# EAGLE design PowerMatrix_1_1 (EAGLE 4.16)
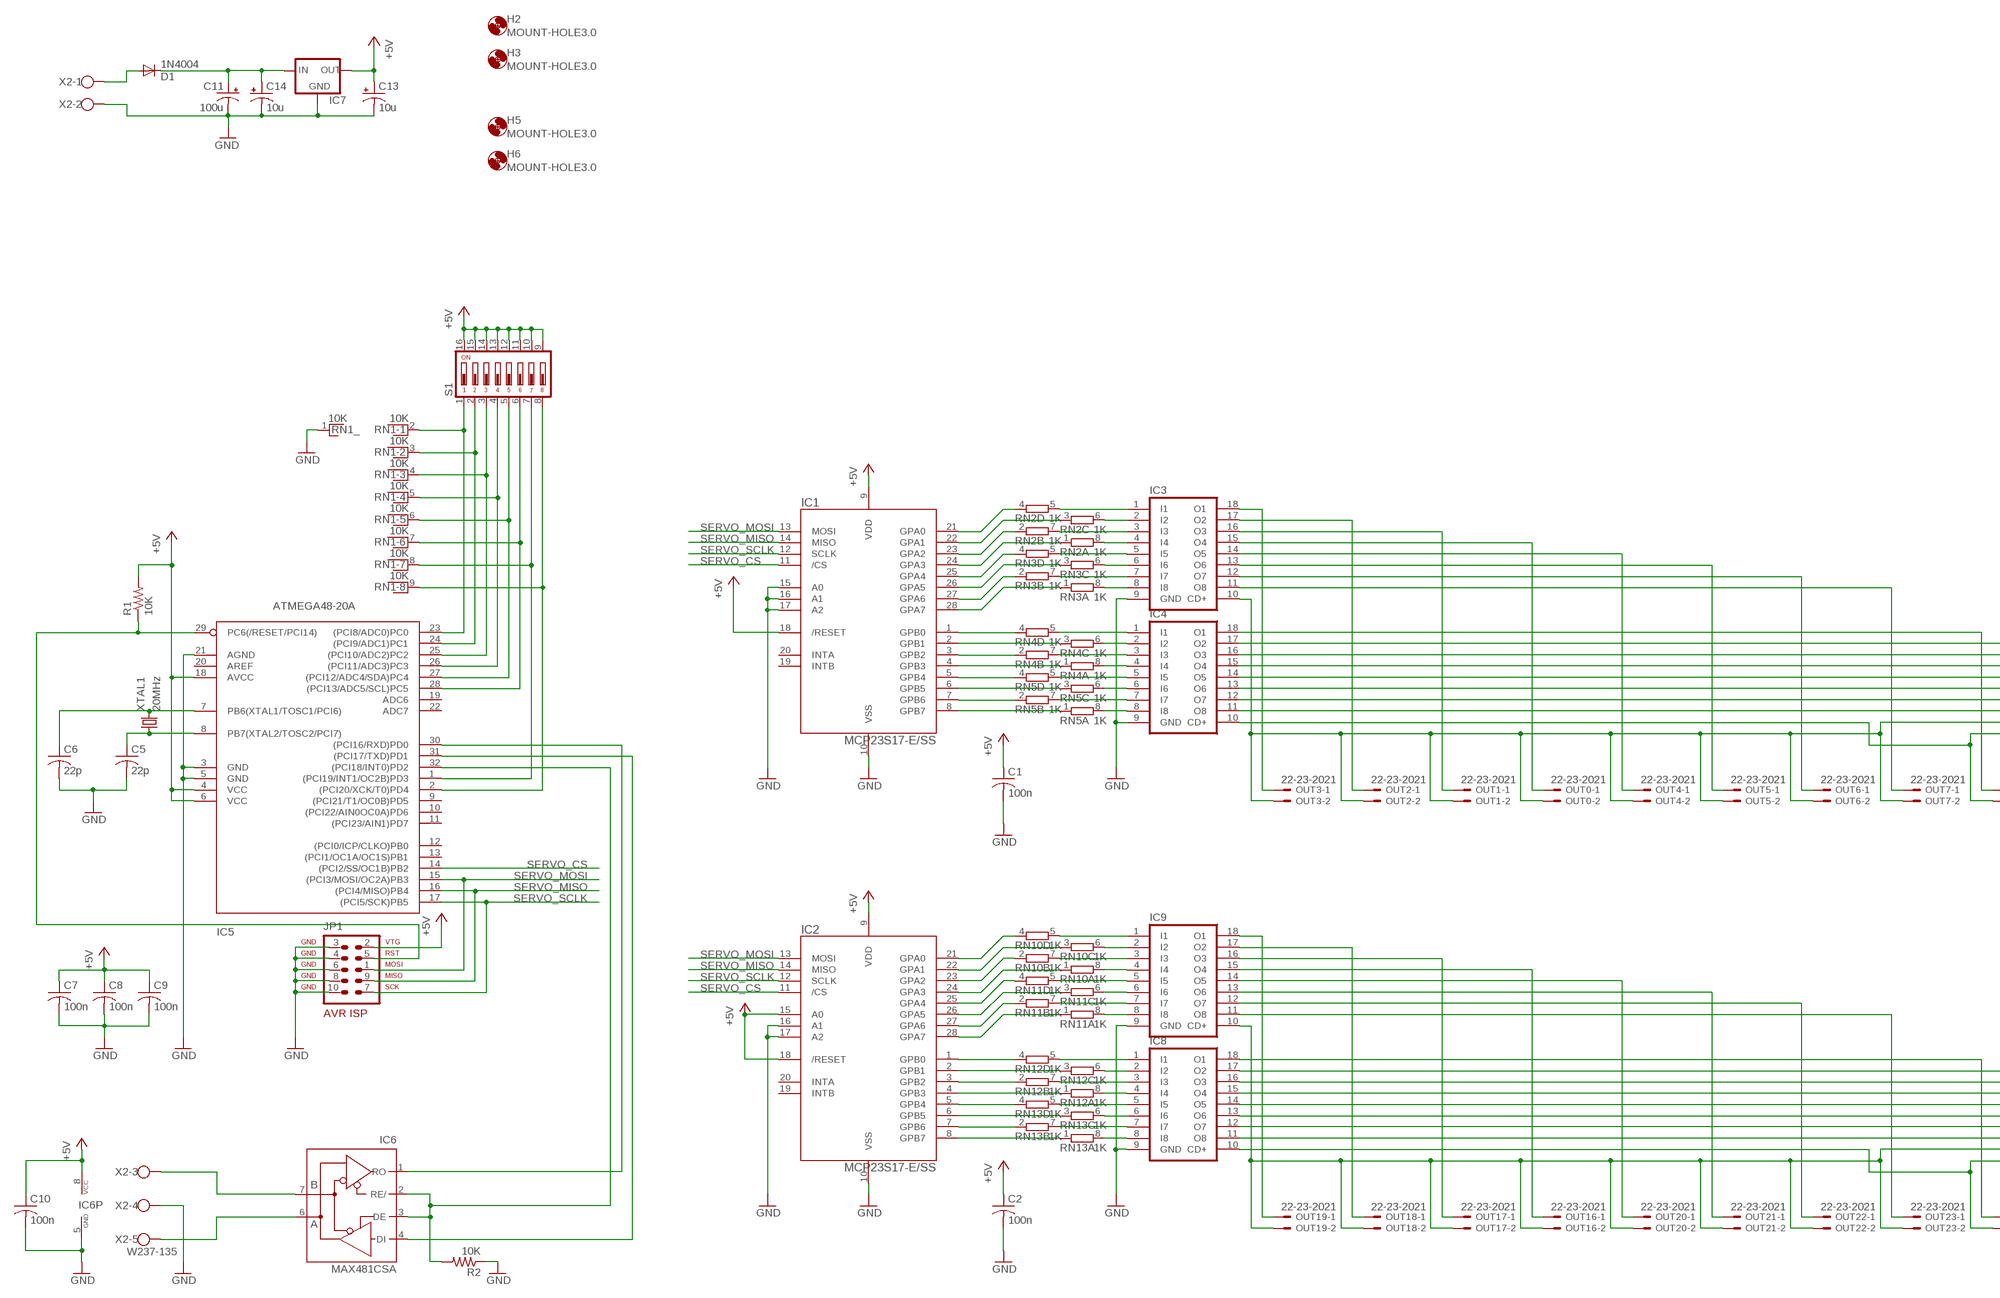
[diagram p0: schematic, sheet 1, part 1 of 2]
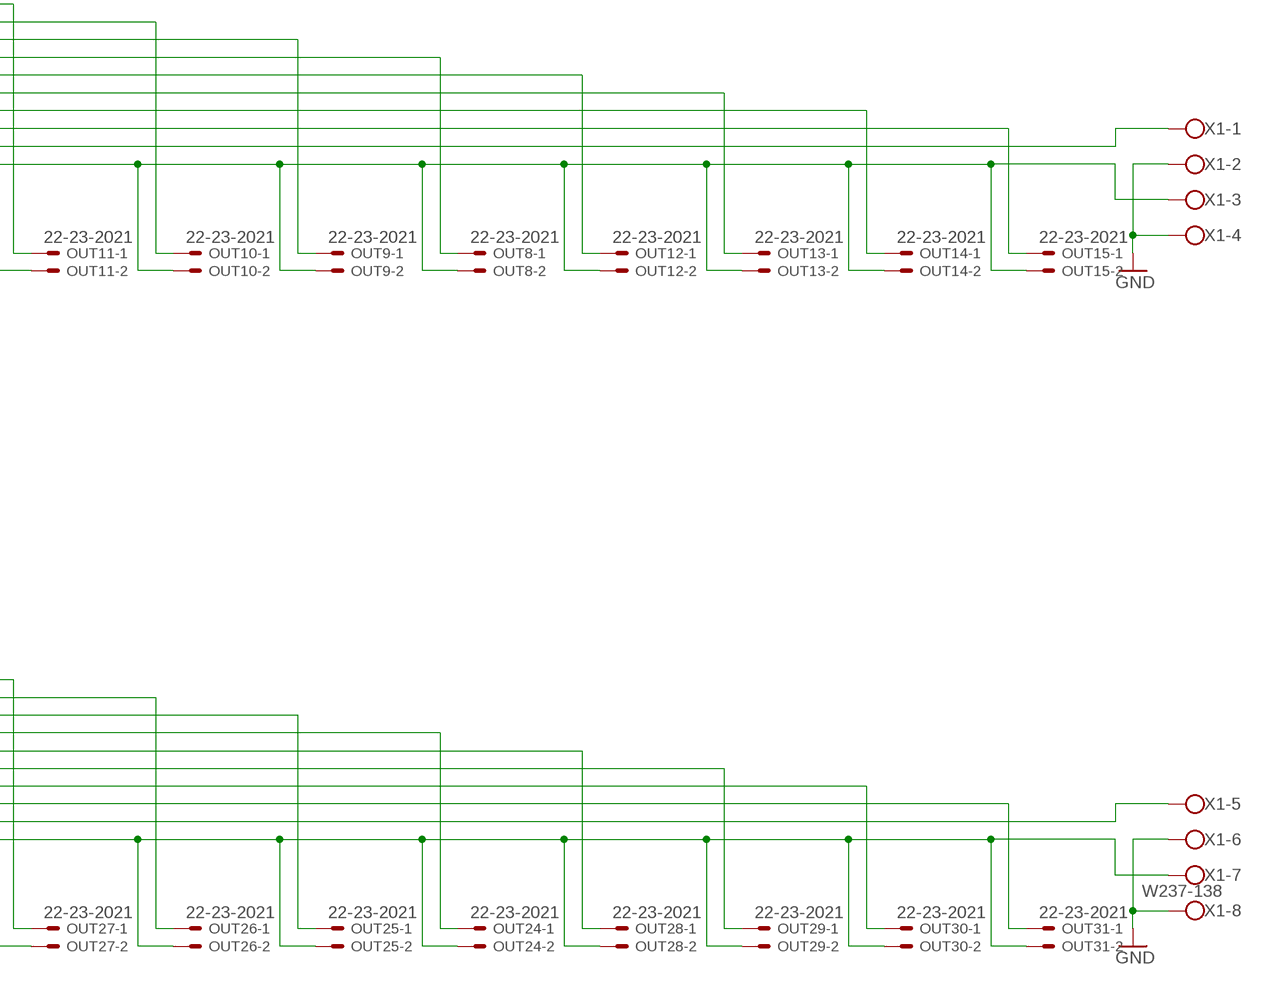
[diagram p1: schematic, sheet 1, part 2 of 2]

## Parts
C1  100n  C-USC0805  [C0805]
C2  100n  C-USC0805  [C0805]
C5  22p  C-USC0805  [C0805]
C6  22p  C-USC0805  [C0805]
C7  100n  C-USC0805  [C0805]
C8  100n  C-USC0805  [C0805]
C9  100n  C-USC0805  [C0805]
C10  100n  C-USC0805  [C0805]
C11  100u  CPOL-USD  [PANASONIC_D]
C13  10u  CPOL-USB  [PANASONIC_B]
C14  10u  CPOL-USB  [PANASONIC_B]
D1  1N4004  [DO41-10]
H2  MOUNT-HOLE3.0  [3,0]
H3  MOUNT-HOLE3.0  [3,0]
H5  MOUNT-HOLE3.0  [3,0]
H6  MOUNT-HOLE3.0  [3,0]
IC1  MCP23S17-E/SS  MCP23S17-E/SS-MFG  [SSOP-28-MFG]
IC2  MCP23S17-E/SS  MCP23S17-E/SS-MFG  [SSOP-28-MFG]
IC3  ULN2803A  [DIL18]
IC4  ULN2803A  [DIL18]
IC5  ATMEGA48-20A  [TQFP32-08]
IC6  MAX481CSA  [SO08]
IC7  LM1117  [SOT223]
IC8  ULN2803A  [DIL18]
IC9  ULN2803A  [DIL18]
JP1  AVR-ISP-10ML  [ML10]
OUT0  22-23-2021  [22-23-2021]
OUT1  22-23-2021  [22-23-2021]
OUT2  22-23-2021  [22-23-2021]
OUT3  22-23-2021  [22-23-2021]
OUT4  22-23-2021  [22-23-2021]
OUT5  22-23-2021  [22-23-2021]
OUT6  22-23-2021  [22-23-2021]
OUT7  22-23-2021  [22-23-2021]
OUT8  22-23-2021  [22-23-2021]
OUT9  22-23-2021  [22-23-2021]
OUT10  22-23-2021  [22-23-2021]
OUT11  22-23-2021  [22-23-2021]
OUT12  22-23-2021  [22-23-2021]
OUT13  22-23-2021  [22-23-2021]
OUT14  22-23-2021  [22-23-2021]
OUT15  22-23-2021  [22-23-2021]
OUT16  22-23-2021  [22-23-2021]
OUT17  22-23-2021  [22-23-2021]
OUT18  22-23-2021  [22-23-2021]
OUT19  22-23-2021  [22-23-2021]
OUT20  22-23-2021  [22-23-2021]
OUT21  22-23-2021  [22-23-2021]
OUT22  22-23-2021  [22-23-2021]
OUT23  22-23-2021  [22-23-2021]
OUT24  22-23-2021  [22-23-2021]
OUT25  22-23-2021  [22-23-2021]
OUT26  22-23-2021  [22-23-2021]
OUT27  22-23-2021  [22-23-2021]
OUT28  22-23-2021  [22-23-2021]
OUT29  22-23-2021  [22-23-2021]
OUT30  22-23-2021  [22-23-2021]
OUT31  22-23-2021  [22-23-2021]
R1  10K  R-US_M0805  [M0805]
R2  10K  R-US_M0805  [M0805]
RN1  10K  RNX9  [RN-10]
RN2  1K  4R-N0603-ARC  [0603-ARC]
RN3  1K  4R-N0603-ARC  [0603-ARC]
RN4  1K  4R-N0603-ARC  [0603-ARC]
RN5  1K  4R-N0603-ARC  [0603-ARC]
RN10  1K  4R-N0603-ARC  [0603-ARC]
RN11  1K  4R-N0603-ARC  [0603-ARC]
RN12  1K  4R-N0603-ARC  [0603-ARC]
RN13  1K  4R-N0603-ARC  [0603-ARC]
S1  DIP08YL  [DIP08YL]
X1  W237-138  [W237-138]
X2  W237-135  [W237-135]
XTAL1  20MHz  CRYSTALHC49S  [HC49/S]

## Nets
+5V: C1.1 C2.1 C7.1 C8.1 C9.1 C10.1 C13.+ IC1.9(VDD) IC1.18(/RESET) IC2.9(VDD) IC2.15(A0) IC2.18(/RESET) IC5.4(VCC) IC5.6(VCC) IC5.18(AVCC) IC6.8(VCC) IC7.2(OUT) JP1.2 R1.2 S1.9 S1.10 S1.11 S1.12 S1.13 S1.14 S1.15 S1.16
GND: C1.2 C2.2 C5.2 C6.2 C7.2 C8.2 C9.2 C10.2 C11.- C13.- C14.- IC1.10(VSS) IC1.15(A0) IC1.16(A1) IC1.17(A2) IC2.10(VSS) IC2.16(A1) IC2.17(A2) IC3.9(GND) IC4.9(GND) IC5.3(GND) IC5.5(GND) IC5.21(AGND) IC6.5(GND) IC7.1(GND) IC8.9(GND) IC9.9(GND) JP1.3 JP1.4 JP1.6 JP1.8 JP1.10 R2.1 RN1.1 X1.2 X1.4 X1.6 X1.8 X2.2 X2.4
N$1: IC3.18(O1) OUT3.1
N$2: IC1.21(GPA0) RN2.4
N$3: IC3.17(O2) OUT2.1
N$4: IC1.22(GPA1) RN2.3
N$5: IC3.16(O3) OUT1.1
N$6: IC1.23(GPA2) RN2.2
N$7: IC3.15(O4) OUT0.1
N$8: IC1.24(GPA3) RN2.1
N$9: IC3.14(O5) OUT4.1
N$10: IC1.25(GPA4) RN3.4
N$11: IC3.13(O6) OUT5.1
N$12: IC1.26(GPA5) RN3.3
N$13: IC3.12(O7) OUT6.1
N$14: IC1.27(GPA6) RN3.2
N$15: IC3.11(O8) OUT7.1
N$16: IC1.28(GPA7) RN3.1
N$17: IC4.18(O1) OUT11.1
N$18: IC1.8(GPB7) RN5.1
N$19: IC4.17(O2) OUT10.1
N$20: IC1.7(GPB6) RN5.2
N$21: IC4.16(O3) OUT9.1
N$22: IC1.6(GPB5) RN5.3
N$23: IC4.15(O4) OUT8.1
N$24: IC1.5(GPB4) RN5.4
N$25: IC4.14(O5) OUT12.1
N$26: IC1.4(GPB3) RN4.1
N$27: IC4.13(O6) OUT13.1
N$28: IC1.3(GPB2) RN4.2
N$29: IC4.12(O7) OUT14.1
N$30: IC1.2(GPB1) RN4.3
N$31: IC4.11(O8) OUT15.1
N$32: IC1.1(GPB0) RN4.4
N$33: IC3.1(I1) RN2.5
N$34: IC3.2(I2) RN2.6
N$35: IC4.10(CD+) OUT8.2 OUT9.2 OUT10.2 OUT11.2 OUT12.2 OUT13.2 OUT14.2 OUT15.2 X1.3
N$36: IC3.3(I3) RN2.7
N$37: IC3.4(I4) RN2.8
N$38: IC3.5(I5) RN3.5
N$39: IC3.6(I6) RN3.6
N$40: IC3.7(I7) RN3.7
N$41: IC3.8(I8) RN3.8
N$42: IC9.10(CD+) OUT16.2 OUT17.2 OUT18.2 OUT19.2 OUT20.2 OUT21.2 OUT22.2 OUT23.2 X1.5
N$43: IC4.1(I1) RN4.5
N$44: IC4.3(I3) RN4.7
N$45: IC4.2(I2) RN4.6
N$46: IC4.4(I4) RN4.8
N$47: IC4.5(I5) RN5.5
N$48: IC4.6(I6) RN5.6
N$49: IC4.7(I7) RN5.7
N$50: IC4.8(I8) RN5.8
N$51: IC2.21(GPA0) RN10.4
N$52: IC2.22(GPA1) RN10.3
N$53: IC9.18(O1) OUT19.1
N$54: IC2.23(GPA2) RN10.2
N$55: IC9.17(O2) OUT18.1
N$56: IC2.24(GPA3) RN10.1
N$57: IC9.16(O3) OUT17.1
N$58: IC2.25(GPA4) RN11.4
N$59: IC9.15(O4) OUT16.1
N$60: IC2.26(GPA5) RN11.3
N$61: IC9.14(O5) OUT20.1
N$62: IC2.27(GPA6) RN11.2
N$63: IC9.13(O6) OUT21.1
N$64: IC2.28(GPA7) RN11.1
N$65: IC9.12(O7) OUT22.1
N$66: IC2.8(GPB7) RN13.1
N$67: IC9.11(O8) OUT23.1
N$68: IC2.7(GPB6) RN13.2
N$69: IC8.18(O1) OUT27.1
N$70: IC2.6(GPB5) RN13.3
N$71: IC8.17(O2) OUT26.1
N$72: IC2.5(GPB4) RN13.4
N$73: IC8.16(O3) OUT25.1
N$74: IC2.4(GPB3) RN12.1
N$75: IC8.15(O4) OUT24.1
N$76: IC2.3(GPB2) RN12.2
N$77: IC8.14(O5) OUT28.1
N$78: IC2.2(GPB1) RN12.3
N$79: IC8.13(O6) OUT29.1
N$80: IC2.1(GPB0) RN12.4
N$81: IC8.12(O7) OUT30.1
N$82: IC8.8(I8) RN13.8
N$83: IC8.11(O8) OUT31.1
N$84: IC8.7(I7) RN13.7
N$85: IC8.10(CD+) OUT24.2 OUT25.2 OUT26.2 OUT27.2 OUT28.2 OUT29.2 OUT30.2 OUT31.2 X1.7
N$86: IC8.6(I6) RN13.6
N$87: C6.1 IC5.7(PB6(XTAL1/TOSC1/PCI6)) XTAL1.2
N$88: C5.1 IC5.8(PB7(XTAL2/TOSC2/PCI7)) XTAL1.1
N$89: IC8.5(I5) RN13.5
N$90: IC8.4(I4) RN12.8
N$91: IC8.3(I3) RN12.7
N$92: IC8.2(I2) RN12.6
N$93: IC8.1(I1) RN12.5
N$94: IC9.8(I8) RN11.8
N$95: IC9.7(I7) RN11.7
N$96: IC9.6(I6) RN11.6
N$97: IC9.5(I5) RN11.5
N$98: IC9.4(I4) RN10.8
N$99: IC9.3(I3) RN10.7
N$100: IC9.2(I2) RN10.6
N$101: IC9.1(I1) RN10.5
N$102: D1.A X2.1
N$104: C11.+ C14.+ D1.C IC7.3(IN)
N$138: IC5.23((PCI8/ADC0)PC0) RN1.2 S1.1
N$139: IC5.24((PCI9/ADC1)PC1) RN1.3 S1.2
N$140: IC5.25((PCI10/ADC2)PC2) RN1.4 S1.3
N$190: IC5.26((PCI11/ADC3)PC3) RN1.5 S1.4
N$191: IC5.27((PCI12/ADC4/SDA)PC4) RN1.6 S1.5
N$192: IC5.28((PCI13/ADC5/SCL)PC5) RN1.7 S1.6
N$209: IC5.1((PCI19/INT1/OC2B)PD3) RN1.8 S1.7
N$210: IC5.2((PCI20/XCK/T0)PD4) RN1.9 S1.8
N$226: IC5.30((PCI16/RXD)PD0) IC6.1(RO)
N$227: IC5.31((PCI17/TXD)PD1) IC6.4(DI)
N$228: IC5.32((PCI18/INT0)PD2) IC6.2(RE/) IC6.3(DE) R2.2
N$231: IC5.29(PC6(/RESET/PCI14)) JP1.5 R1.1
RS285_A: IC6.6(A) X2.5
RS485_B: IC6.7(B) X2.3
SERVO_CS: IC1.11(/CS) IC2.11(/CS) IC5.14((PCI2/SS/OC1B)PB2)
SERVO_MISO: IC1.14(MISO) IC2.14(MISO) IC5.16((PCI4/MISO)PB4) JP1.9
SERVO_MOSI: IC1.13(MOSI) IC2.13(MOSI) IC5.15((PCI3/MOSI/OC2A)PB3) JP1.1
SERVO_SCLK: IC1.12(SCLK) IC2.12(SCLK) IC5.17((PCI5/SCK)PB5) JP1.7
SRV0: IC3.10(CD+) OUT0.2 OUT1.2 OUT2.2 OUT3.2 OUT4.2 OUT5.2 OUT6.2 OUT7.2 X1.1
Unconnected: IC1.19(INTB) IC1.20(INTA) IC2.19(INTB) IC2.20(INTA) IC5.9((PCI21/T1/OC0B)PD5) IC5.10((PCI22/AIN0OC0A)PD6) IC5.11((PCI23/AIN1)PD7) IC5.12((PCI0/ICP/CLKO)PB0) IC5.13((PCI1/OC1A/OC1S)PB1) IC5.19(ADC6) IC5.20(AREF) IC5.22(ADC7) RN1.10

## Library data of the parts
C1 C2 C5-C10 = rcl:C-US: CAPACITOR, American symbol
C11 C13 C14 = rcl:CPOL-US: POLARIZED CAPACITOR, American symbol
D1 = diode:1N4004: DIODE general purpose rectifier, 1 A
H2 H3 H5 H6 = holes:MOUNT-HOLE: MOUNTING HOLE with drill center marker
IC1 IC2 = rbg-microchip-ioexpander:MCP23S17
IC3 IC4 IC8 IC9 = uln-udn:ULN2803A: DRIVER ARRAY
IC5 = avr:ATMEGA48: MICROCONTROLLER 4 Kbytes FLASH 512 Bytes SRAM 256 Bytes EEPROM USART 8-channel 10 bit ADC
IC6 = maxim:MAX481CSA: RS485 TRANSEIVER
IC7 = v-reg-3:LM1117
JP1 = atmel-1:AVR-ISP-10: AVR ISP-10 Serial Programming Header
OUT0 OUT1-OUT31 = con-molex:22-23-2021: .100" (2.54mm) Center Header - 2 Pin
R1 R2 = rcl:R-US_: RESISTOR, American symbol
RN1 = resistor-net:RNX9: RESISTOR NETWORK
RN2-RN5 RN10-RN13 = resistor-dil:4R-N: Array Chip Resistor Source: RS Component / Phycomp
S1 = switch-dil:DIP08YL: DIL/CODE SWITCH
X1 = rbg-generic-screwterm-5mm:W237-138
X2 = rbg-generic-screwterm-5mm:W237-135
XTAL1 = crystal:CRYSTAL: CRYSTAL

## Board
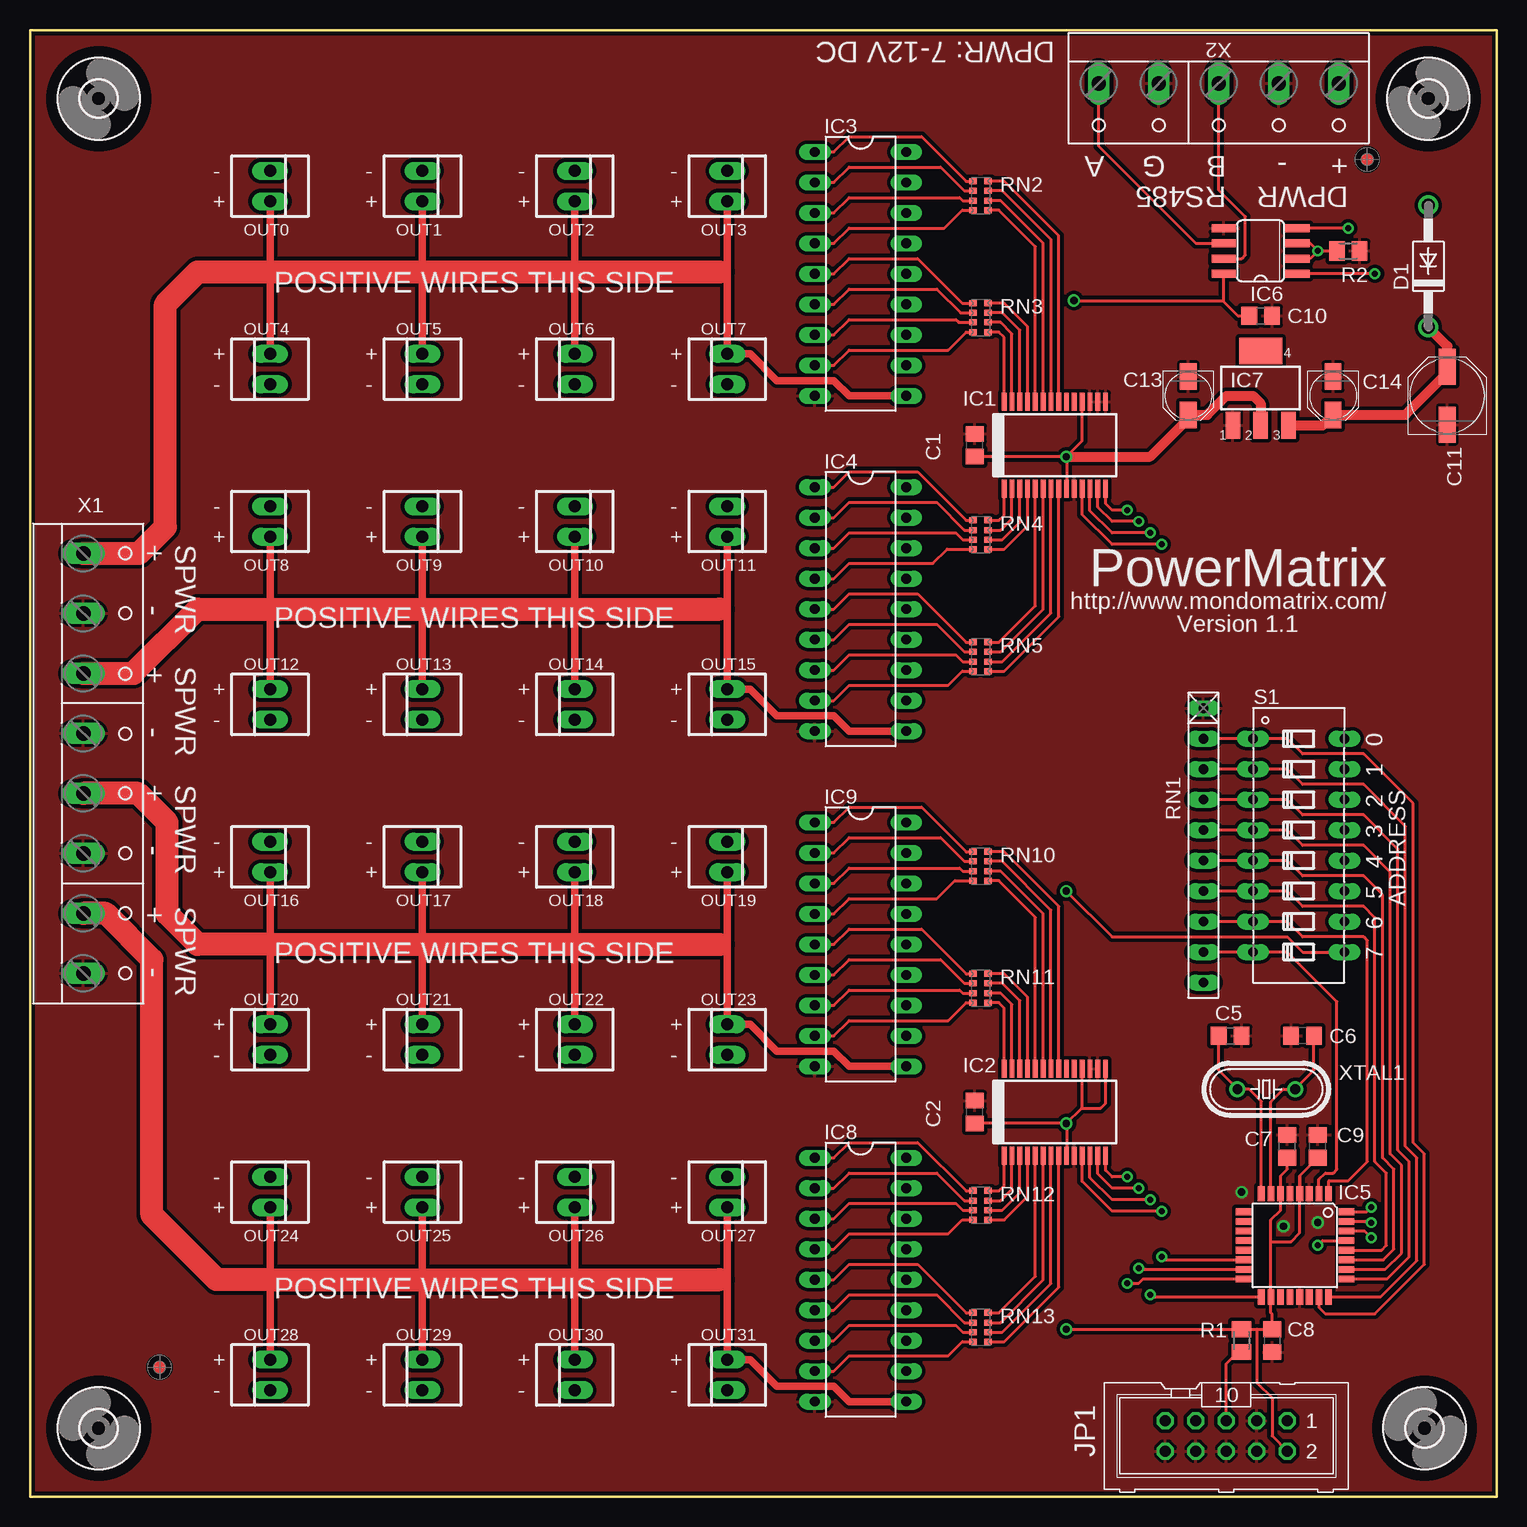
[diagram p2: board, top side]
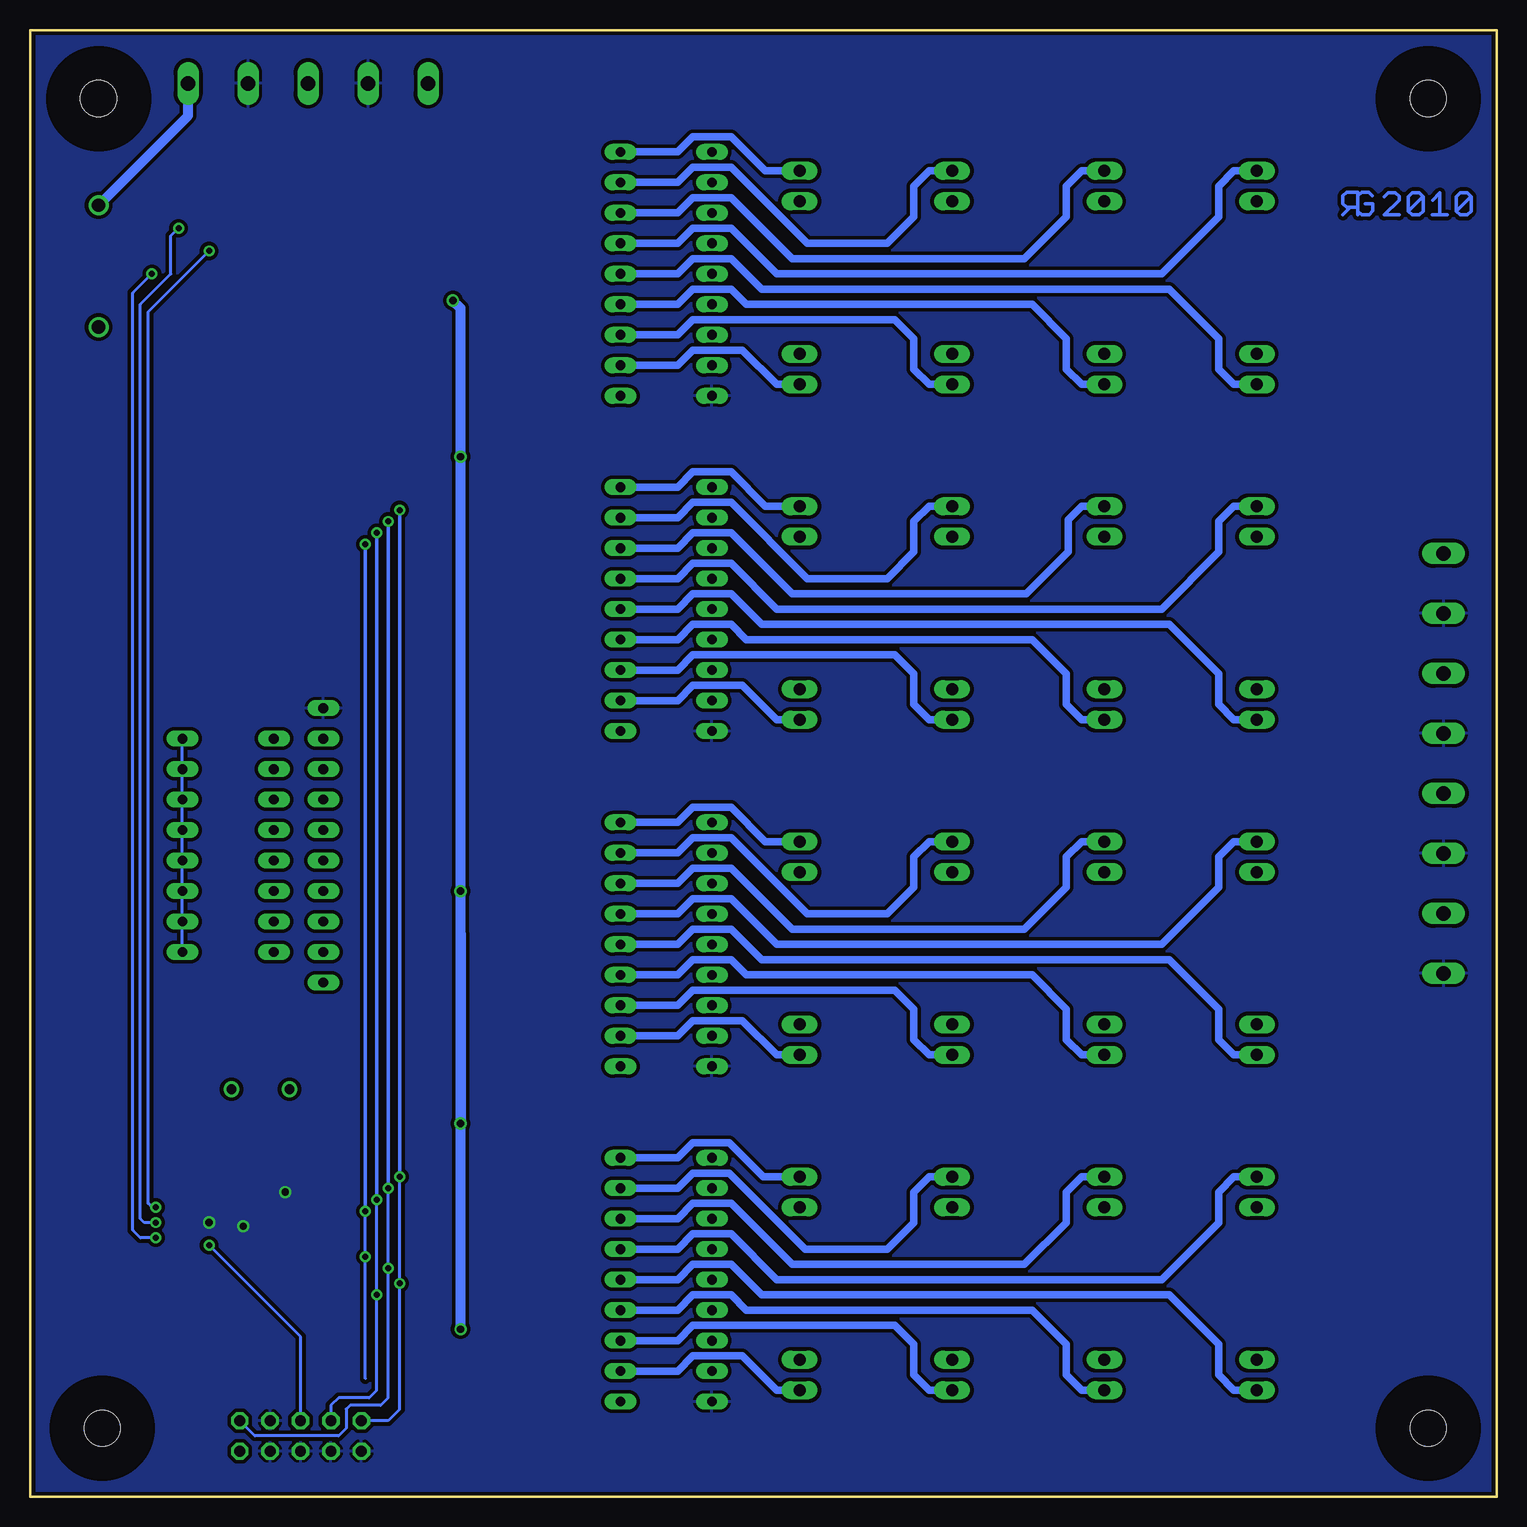
[diagram p3: board, bottom side, seen from below]

Size 122.24 x 122.24 mm. Coordinates in mm from the lower left corner, seen from the top.
Outline: 0,0 0,122.24 122.24,122.24 122.24,0 0,0
Copper layers (1*16): Top 0.035mm / dielectric 1.5mm / Bottom 0.035mm
Design rules "default": minimum track width 8mil, minimum drill 19mil, track to track 8mil, track to pad 8mil, pad to pad 8mil, via to via 8mil, smd to smd 8mil, copper to edge 10mil, drill to drill 8mil, minimum pad ring 10mil, minimum via ring 8mil, stop-mask expansion 4mil, vias tented up to drill 0mil, thermal gap 10mil

### Footprints (pad centres in the part's own frame; a part is rotated, then mirrored left to right if it is on the bottom)
C0805 = smd 1.3 x 1.5: 1 -0.95,0; 2 0.95,0
PANASONIC_D = smd 3 x 1.4: + 2.4,0; - -2.4,0
PANASONIC_B = smd 2.2 x 1.4: + 1.6,0; - -1.6,0
DO41-10 = drill 1.118 round: A 5.08,0; C -5.08,0
3,0 = hole 3: 0,0
SSOP-28-MFG = smd 0.4 x 1.5: 1 -4.225,-3.625; 2 -3.575,-3.625; 3 -2.925,-3.625; 4 -2.275,-3.625; 5 -1.625,-3.625; 6 -0.975,-3.625; 7 -0.325,-3.625; 8 0.325,-3.625; 9 0.975,-3.625; 10 1.625,-3.625; 11 2.275,-3.625; 12 2.925,-3.625; 13 3.575,-3.625; 14 4.225,-3.625; 15 4.225,3.625; 16 3.575,3.625; 17 2.925,3.625; 18 2.275,3.625; 19 1.625,3.625; 20 0.975,3.625; 21 0.325,3.625; 22 -0.325,3.625; 23 -0.975,3.625; 24 -1.625,3.625; 25 -2.275,3.625; 26 -2.925,3.625; 27 -3.575,3.625; 28 -4.225,3.625
DIL18 = drill 0.813 long: 1 -10.16,-3.81; 2 -7.62,-3.81; 3 -5.08,-3.81; 4 -2.54,-3.81; 5 0,-3.81; 6 2.54,-3.81; 7 5.08,-3.81; 8 7.62,-3.81; 9 10.16,-3.81; 10 10.16,3.81; 11 7.62,3.81; 12 5.08,3.81; 13 2.54,3.81; 14 0,3.81; 15 -2.54,3.81; 16 -5.08,3.81; 17 -7.62,3.81; 18 -10.16,3.81
TQFP32-08 = smd 1.27 x 0.559: 1 -4.293,2.8; 2 -4.293,2; 3 -4.293,1.2; 4 -4.293,0.4; 5 -4.293,-0.4; 6 -4.293,-1.2; 7 -4.293,-2; 8 -4.293,-2.8; 17 4.293,-2.8; 18 4.293,-2; 19 4.293,-1.2; 20 4.293,-0.4; 21 4.293,0.4; 22 4.293,1.2; 23 4.293,2; 24 4.293,2.8 | smd 0.559 x 1.27: 9 -2.8,-4.293; 10 -2,-4.293; 11 -1.2,-4.293; 12 -0.4,-4.293; 13 0.4,-4.293; 14 1.2,-4.293; 15 2,-4.293; 16 2.8,-4.293; 25 2.8,4.293; 26 2,4.293; 27 1.2,4.293; 28 0.4,4.293; 29 -0.4,4.293; 30 -1.2,4.293; 31 -2,4.293; 32 -2.8,4.293
SO08 = smd 0.66 x 2.032: 1 -1.905,-3.073; 2 -0.635,-3.073; 3 0.635,-3.073; 4 1.905,-3.073; 5 1.905,3.073; 6 0.635,3.073; 7 -0.635,3.073; 8 -1.905,3.073
SOT223 = smd 1.219 x 2.235: 1 -2.311,-3.099; 2 0,-3.099; 3 2.311,-3.099 | smd 3.6 x 2.2: 4 0,3.099
ML10 = drill 0.914 octagon: 1 -5.08,-1.27; 2 -5.08,1.27; 3 -2.54,-1.27; 4 -2.54,1.27; 5 0,-1.27; 6 0,1.27; 7 2.54,-1.27; 8 2.54,1.27; 9 5.08,-1.27; 10 5.08,1.27
22-23-2021 = drill 1 long: 1 -1.27,0; 2 1.27,0
M0805 = smd 1.3 x 1.6: 1 -0.95,0; 2 0.95,0
RN-10 = drill 0.813 long: 1 -11.43,0; 2 -8.89,0; 3 -6.35,0; 4 -3.81,0; 5 -1.27,0; 6 1.27,0; 7 3.81,0; 8 6.35,0; 9 8.89,0; 10 11.43,0
0603-ARC = smd 0.5 x 0.65: 1 -1.2,-0.625; 2 -0.4,-0.625; 3 0.4,-0.625; 4 1.2,-0.625; 5 1.2,0.625; 6 0.4,0.625; 7 -0.4,0.625; 8 -1.2,0.625
DIP08YL = drill 0.813 long: 1 -8.89,-3.81; 2 -6.35,-3.81; 3 -3.81,-3.81; 4 -1.27,-3.81; 5 1.27,-3.81; 6 3.81,-3.81; 7 6.35,-3.81; 8 8.89,-3.81; 9 8.89,3.81; 10 6.35,3.81; 11 3.81,3.81; 12 1.27,3.81; 13 -1.27,3.81; 14 -3.81,3.81; 15 -6.35,3.81; 16 -8.89,3.81
W237-138 = drill 1.194 long: 1 -17.5,-1.27; 2 -12.5,-1.27; 3 -7.5,-1.27; 4 -2.5,-1.27; 5 2.5,-1.27; 6 7.5,-1.27; 7 12.5,-1.27; 8 17.5,-1.27
W237-135 = drill 1.194 long: 1 -10,-1.27; 2 -5,-1.27; 3 0,-1.27; 4 5,-1.27; 5 10,-1.27
HC49/S = drill 0.813 round: 1 -2.413,0; 2 2.413,0

### Placement (x,y rotation side)
C1  78.74,87.63 90 top
C2  78.74,32.07 90 top
C5  100.01,38.42 0 top
C6  106.05,38.42 180 top
C7  104.78,29.21 90 top
C8  103.5,13.02 270 top
C9  107.31,29.21 90 top
C10  102.55,98.42 0 top
C11  118.11,91.76 90 top
C13  96.52,91.76 270 top
C14  108.58,91.76 270 top
D1  116.52,102.55 90 top
H2  5.71,116.52 0 top
H3  116.52,116.52 0 top
H5  116.2,5.71 90 top
H6  5.71,5.71 90 top
IC1  85.41,87.63 0 top
IC2  85.41,32.07 0 top
IC3  69.22,101.92 270 top
IC4  69.22,73.98 270 top
IC5  105.41,20.95 270 top
IC6  102.55,103.82 90 top
IC7  102.55,92.39 0 top
IC8  69.22,18.1 270 top
IC9  69.22,46.04 270 top
JP1  99.69,5.08 180 top
OUT0  20,109.22 270 top
OUT1  32.7,109.22 270 top
OUT2  45.4,109.22 270 top
OUT3  58.1,109.22 270 top
OUT4  20,93.98 90 top
OUT5  32.7,93.98 90 top
OUT6  45.4,93.98 90 top
OUT7  58.1,93.98 90 top
OUT8  20,81.28 270 top
OUT9  32.7,81.28 270 top
OUT10  45.4,81.28 270 top
OUT11  58.1,81.28 270 top
OUT12  20,66.04 90 top
OUT13  32.7,66.04 90 top
OUT14  45.4,66.04 90 top
OUT15  58.1,66.04 90 top
OUT16  20,53.34 270 top
OUT17  32.7,53.34 270 top
OUT18  45.4,53.34 270 top
OUT19  58.1,53.34 270 top
OUT20  20,38.1 90 top
OUT21  32.7,38.1 90 top
OUT22  45.4,38.1 90 top
OUT23  58.1,38.1 90 top
OUT24  20,25.4 270 top
OUT25  32.7,25.4 270 top
OUT26  45.4,25.4 270 top
OUT27  58.1,25.4 270 top
OUT28  20,10.16 90 top
OUT29  32.7,10.16 90 top
OUT30  45.4,10.16 90 top
OUT31  58.1,10.16 90 top
R1  100.97,13.02 90 top
R2  109.86,103.82 180 top
RN1  97.79,54.29 270 top
RN2  79.22,108.43 90 top
RN3  79.22,98.27 90 top
RN4  79.22,80.17 90 top
RN5  79.22,70.01 90 top
RN10  79.22,52.55 90 top
RN11  79.22,42.39 90 top
RN12  79.22,24.29 90 top
RN13  79.22,14.13 90 top
S1  105.73,54.29 270 top
U$1  [RGLOGO_SMALL_2010]  11.43,106.68 0 bottom
U$2  [FIDUCIAL_G10]  111.44,111.44 180 top
U$4  [FIDUCIAL_G10]  10.79,10.79 0 top
X1  5.71,61.12 270 top
X2  99.06,116.52 180 top
XTAL1  103.03,33.97 0 top

### Tracks (layer width: path | path; a pad name or v marks a point on that pad's centre or on a via)
+5V  (via drill 0.6)
  Top 0.254: C7.1 104.78,27.3 104.21,26.74 IC5.6 104.21,23.88 103.41,23.08 103.41,21.27 | C9.1 105.81,26.75 | 105.81,26.75 IC5.4 | 105.81,26.75 105.81,21.99 105.09,21.27 103.41,21.27 | C8.1 103.5,15.24 103.41,15.34 IC5.18 103.41,21.27 | C8.1 | 102.23,13.97 R1.2 v86.36,13.97 | 102.23,13.97 C8.1 | IC2.15 89.63,32.8 89.22,32.38 87.63,32.38 | IC2.18 87.68,32.44 87.63,32.38 | IC1.18 87.68,88 v86.36,86.68 | JP1.2 103.5,5.08 103.5,8.26 102.23,9.53 102.23,13.97 | 102.23,13.97 | IC6.8 99.48,99.59 100.65,98.42 | S1.9 106.05,45.4 104.78,46.67 90.17,46.67 v86.36,50.48 | C1.1 v86.36,86.68 | IC1.9 86.38,86.66 v86.36,86.68 | C2.1 v86.36,31.11 | IC2.9 86.38,31.09 v86.36,31.11 | v86.36,31.11 87.63,32.38 | 100.65,98.42 C10.1 | 100.65,98.42 99.38,99.69 v87,99.69
  Top 0.813: IC7.2 102.55,91.12 101.92,91.76 99.69,91.76 98.11,90.17 C13.+ | C13.+ | C13.+ 96.52,89.85 93.34,86.68 v86.36,86.68
  Bottom 0.254: S1.16 S1.15 S1.14 S1.13 S1.12 S1.11 S1.10 S1.9
  Bottom 0.813: v86.36,13.97 86.36,46.99 | 86.36,46.99 v86.36,31.11 | 86.36,46.99 v86.36,50.48 v86.36,86.68 86.36,99.06 v87,99.69
GND  (via drill 0.6)
  other vias: 100.97,25.4 107.31,22.86 104.46,22.54
  pour Top (isolate 0.305): -1.59,123.83 123.51,123.83 123.51,-0.95 -1.59,-0.95
  pour Bottom (isolate 0.305): -1.59,123.83 123.51,123.83 123.51,-0.95 -1.59,-0.95
N$1
  Bottom 0.61: IC3.18 68.26,112.08 66.99,113.35 63.82,113.35 60.96,110.49 OUT3.1
N$2
  Top 0.254: RN2.4 81.19,109.63 85.72,105.09 85.72,91.12 85.73,91.13 IC1.21
N$3
  Bottom 0.61: IC3.17 68.26,109.54 66.99,110.81 63.82,110.81 57.47,104.46 50.8,104.46 48.58,106.68 48.58,109.22 47.31,110.49 OUT2.1
N$4
  Top 0.254: RN2.3 81.04,108.83 85.09,104.78 85.09,91.12 85.08,91.13 IC1.22
N$5
  Bottom 0.61: IC3.16 68.26,107 66.99,108.27 63.82,108.27 58.74,103.19 39.37,103.19 35.88,106.68 35.88,109.22 34.61,110.49 OUT1.1
N$6
  Top 0.254: IC1.23 84.43,104.48 80.89,108.03 RN2.2
N$7
  Bottom 0.61: IC3.15 68.26,104.46 66.99,105.73 63.82,105.73 60.01,101.92 27.94,101.92 23.18,106.68 23.18,109.22 21.91,110.49 OUT0.1 | OUT0.1
N$8
  Top 0.254: IC1.24 83.78,104.18 80.73,107.23 RN2.1
N$9
  Bottom 0.61: IC3.14 68.26,101.92 66.99,103.19 63.82,103.19 61.28,100.65 27.3,100.65 23.18,96.52 23.18,93.98 21.91,92.71 OUT4.1 | OUT4.1
N$10
  Top 0.254: IC1.25 83.13,97.53 81.19,99.47 RN3.4
N$11
  Bottom 0.61: IC3.13 68.26,99.38 66.99,100.65 63.82,100.65 62.55,99.38 38.73,99.38 35.88,96.52 35.88,93.98 34.61,92.71 OUT5.1 | OUT5.1
N$12
  Top 0.254: IC1.26 82.48,97.22 81.04,98.67 RN3.3
N$13
  Bottom 0.61: IC3.12 68.26,96.84 66.99,98.11 50.16,98.11 48.58,96.52 48.58,93.98 47.31,92.71 OUT6.1 | OUT6.1
N$14
  Top 0.254: IC1.27 81.83,96.92 80.89,97.87 RN3.2
N$15
  Bottom 0.61: IC3.11 68.26,94.3 66.99,95.57 62.87,95.57 60.01,92.71 OUT7.1
N$16
  Top 0.254: IC1.28 81.18,96.62 80.73,97.07 RN3.1
N$17
  Bottom 0.61: IC4.18 68.26,84.14 66.99,85.41 63.82,85.41 60.96,82.55 OUT11.1
N$18
  Top 0.254: RN5.1 81.19,68.81 85.73,73.35 IC1.8
N$19
  Bottom 0.61: IC4.17 68.26,81.6 66.99,82.87 63.82,82.87 57.47,76.52 50.8,76.52 48.58,78.74 48.58,81.28 47.31,82.55 OUT10.1
N$20
  Top 0.254: RN5.2 81.04,69.61 85.08,73.65 IC1.7
N$21
  Bottom 0.61: IC4.16 68.26,79.06 66.99,80.33 63.82,80.33 58.74,75.25 39.21,75.25 35.72,78.74 35.72,81.44 34.61,82.55 OUT9.1
N$22
  Top 0.254: RN5.3 80.89,70.41 84.43,73.95 IC1.6
N$23
  Bottom 0.61: IC4.15 68.26,76.52 66.99,77.79 63.82,77.79 60.01,73.98 27.94,73.98 23.18,78.74 23.18,81.28 21.91,82.55 OUT8.1
N$24
  Top 0.254: IC1.5 83.78,74.26 80.73,71.21 RN5.4
N$25
  Bottom 0.61: IC4.14 68.26,73.98 66.99,75.25 63.82,75.25 61.28,72.71 27.3,72.71 23.18,68.58 23.18,66.04 21.91,64.77 OUT12.1
N$26
  Top 0.254: IC1.4 83.13,80.91 81.19,78.97 RN4.1
N$27
  Bottom 0.61: IC4.13 68.26,71.44 66.99,72.71 63.82,72.71 62.55,71.44 38.73,71.44 35.88,68.58 35.88,66.04 34.61,64.77 OUT13.1
N$28
  Top 0.254: IC1.3 82.48,81.21 81.04,79.77 RN4.2
N$29
  Bottom 0.61: IC4.12 68.26,68.9 66.99,70.17 50.16,70.17 48.58,68.58 48.58,66.04 47.31,64.77 OUT14.1
N$30
  Top 0.254: IC1.2 81.83,81.52 80.89,80.57 RN4.3
N$31
  Bottom 0.61: IC4.11 68.26,66.36 66.99,67.63 62.87,67.63 60.01,64.77 OUT15.1
N$32
  Top 0.254: IC1.1 81.18,81.82 80.73,81.37 RN4.4
N$33
  Top 0.254: RN2.5 78.02,109.63 74.3,113.35 68.26,113.35 66.99,112.08 IC3.1
N$34
  Top 0.254: RN2.6 77.86,108.83 75.88,110.81 68.26,110.81 66.99,109.54 IC3.2
N$35
  Top 0.61: OUT9.2 32.7,73.98 OUT13.2 | 45.4,73.98 45.4,74.14 | 45.4,73.98 OUT14.2 | 45.4,73.98 OUT10.2 | 57.47,73.98 57.94,73.98 | 57.94,73.98 58.1,73.82 OUT15.2 60.01,67.31 62.23,65.09 66.99,65.09 68.26,63.82 IC4.10 | 57.94,73.98 57.94,74.14 58.1,74.3 OUT11.2 | OUT12.2 20,73.98 OUT8.2
  Top 1.93: 57.47,73.98 45.4,73.98 32.7,73.98 20,73.98 13.97,73.98 8.61,68.62 X1.3
N$36
  Top 0.254: RN2.7 77.71,108.03 77.47,108.27 68.26,108.27 66.99,107 IC3.3
N$37
  Top 0.254: RN2.8 77.7,107.23 76.2,105.73 68.26,105.73 66.99,104.46 IC3.4
N$38
  Top 0.254: RN3.5 77.7,99.47 73.98,103.19 68.26,103.19 66.99,101.92 IC3.5
N$39
  Top 0.254: RN3.6 77.55,98.67 75.56,100.65 68.26,100.65 66.99,99.38 IC3.6
N$40
  Top 0.254: RN3.7 77.39,97.87 77.15,98.11 68.26,98.11 66.99,96.84 IC3.7
N$41
  Top 0.254: RN3.8 78.02,97.07 76.52,95.57 68.26,95.57 66.99,94.3 IC3.8
N$42
  Top 0.61: OUT20.2 20,46.04 OUT16.2 | 32.7,46.2 32.7,46.04 | 32.7,46.2 OUT17.2 | 32.7,46.2 OUT21.2 | 45.4,46.04 OUT18.2 | 45.4,46.04 OUT22.2 | 57.47,46.04 57.78,46.04 | 57.78,46.04 58.1,45.72 OUT23.2 60.01,39.37 62.23,37.15 66.99,37.15 68.26,35.88 IC9.10 | OUT19.2 58.1,46.35 57.78,46.04
  Top 1.93: 57.47,46.04 45.4,46.04 32.7,46.04 20,46.04 13.97,46.04 11.43,48.58 11.43,56.2 9.01,58.62 X1.5
N$43
  Top 0.254: RN4.5 78.02,81.37 73.98,85.41 68.26,85.41 66.99,84.14 IC4.1
N$44
  Top 0.254: IC4.3 66.99,79.06 68.26,80.33 77.15,80.33 77.71,79.77 RN4.7
N$45
  Top 0.254: IC4.2 66.99,81.6 68.26,82.87 75.56,82.87 77.86,80.57 RN4.6
N$46
  Top 0.254: RN4.8 76.43,78.97 75.25,77.79 68.26,77.79 66.99,76.52 IC4.4 65.09,76.52
N$47
  Top 0.254: RN5.5 78.02,71.21 73.98,75.25 68.26,75.25 66.99,73.98 IC4.5
N$48
  Top 0.254: RN5.6 77.86,70.41 75.56,72.71 68.26,72.71 66.99,71.44 IC4.6
N$49
  Top 0.254: RN5.7 77.71,69.61 77.15,70.17 68.26,70.17 66.99,68.9 IC4.7
N$50
  Top 0.254: RN5.8 77.7,68.81 76.52,67.63 68.26,67.63 66.99,66.36 IC4.8
N$51
  Top 0.254: IC2.21 85.73,49.2 81.19,53.75 RN10.4
N$52
  Top 0.254: IC2.22 85.08,48.9 81.04,52.95 RN10.3
N$53
  Bottom 0.61: IC9.18 68.26,56.2 66.99,57.47 63.82,57.47 60.96,54.61 OUT19.1 | OUT19.1
N$54
  Top 0.254: IC2.23 84.43,48.6 80.89,52.15 RN10.2
N$55
  Bottom 0.61: IC9.17 68.26,53.66 66.99,54.93 63.82,54.93 57.47,48.58 50.8,48.58 48.58,50.8 48.58,53.34 47.31,54.61 OUT18.1
N$56
  Top 0.254: IC2.24 83.78,48.3 80.73,51.35 RN10.1
N$57
  Bottom 0.61: IC9.16 68.26,51.12 66.99,52.39 63.82,52.39 58.74,47.31 39.37,47.31 35.88,50.8 35.88,53.34 34.61,54.61 OUT17.1 | OUT17.1
N$58
  Top 0.254: IC2.25 83.13,41.65 81.19,43.59 RN11.4
N$59
  Bottom 0.61: IC9.15 68.26,48.58 66.99,49.85 63.82,49.85 60.01,46.04 27.94,46.04 23.18,50.8 23.18,53.34 21.91,54.61 OUT16.1
N$60
  Top 0.254: IC2.26 82.48,41.34 81.04,42.79 RN11.3
N$61
  Bottom 0.61: IC9.14 68.26,46.04 66.99,47.31 63.82,47.31 61.28,44.77 27.3,44.77 23.18,40.64 23.18,38.1 21.91,36.83 OUT20.1
N$62
  Top 0.254: IC2.27 81.83,41.04 80.89,41.99 RN11.2
N$63
  Bottom 0.61: IC9.13 68.26,43.5 66.99,44.77 63.82,44.77 62.55,43.5 38.73,43.5 35.88,40.64 35.88,38.1 34.61,36.83 OUT21.1
N$64
  Top 0.254: IC2.28 81.18,40.74 80.73,41.19 RN11.1
N$65
  Bottom 0.61: IC9.12 68.26,40.96 66.99,42.23 50.16,42.23 48.58,40.64 48.58,38.1 47.31,36.83 OUT22.1
N$66
  Top 0.254: IC2.8 85.73,17.47 81.19,12.93 RN13.1
N$67
  Bottom 0.61: IC9.11 68.26,38.42 66.99,39.69 62.87,39.69 60.01,36.83 OUT23.1
N$68
  Top 0.254: IC2.7 85.08,17.77 81.04,13.73 RN13.2
N$69
  Bottom 0.61: IC8.18 68.26,28.26 66.99,29.53 63.98,29.53 61.12,26.67 OUT27.1
N$70
  Top 0.254: IC2.6 84.43,18.07 80.89,14.53 RN13.3
N$71
  Bottom 0.61: IC8.17 68.26,25.72 66.99,26.99 63.98,26.99 57.63,20.64 50.8,20.64 48.58,22.86 48.58,25.4 47.31,26.67 OUT26.1
N$72
  Top 0.254: IC2.5 83.78,18.38 80.73,15.33 RN13.4
N$73
  Bottom 0.61: IC8.16 68.26,23.18 66.99,24.45 63.82,24.45 58.74,19.37 39.37,19.37 35.88,22.86 35.88,25.4 34.61,26.67 OUT25.1
N$74
  Top 0.254: IC2.4 83.13,25.03 81.19,23.09 RN12.1
N$75
  Bottom 0.61: IC8.15 68.26,20.64 66.99,21.91 63.82,21.91 60.01,18.1 27.94,18.1 23.18,22.86 23.18,25.4 21.91,26.67 OUT24.1
N$76
  Top 0.254: IC2.3 82.48,25.33 81.04,23.89 RN12.2
N$77
  Bottom 0.61: IC8.14 68.26,18.1 66.99,19.37 63.82,19.37 61.28,16.83 27.3,16.83 23.18,12.7 23.18,10.16 21.91,8.89 OUT28.1
N$78
  Top 0.254: IC2.2 81.83,25.64 80.89,24.69 RN12.3
N$79
  Bottom 0.61: IC8.13 68.26,15.56 66.99,16.83 63.82,16.83 62.55,15.56 38.73,15.56 35.88,12.7 35.88,10.16 34.61,8.89 OUT29.1
N$80
  Top 0.254: IC2.1 81.18,25.94 80.73,25.49 RN12.4
N$81
  Bottom 0.61: IC8.12 68.26,13.02 66.99,14.29 50.16,14.29 48.58,12.7 48.58,10.16 47.31,8.89 OUT30.1
N$82
  Top 0.254: RN13.8 77.7,12.93 76.52,11.75 68.26,11.75 66.99,10.48 IC8.8
N$83
  Bottom 0.61: IC8.11 68.26,10.48 66.99,11.75 62.87,11.75 60.01,8.89 OUT31.1
N$84
  Top 0.254: RN13.7 77.71,13.73 77.15,14.29 68.26,14.29 66.99,13.02 IC8.7
N$85
  Top 0.61: 57.78,18.1 58.1,17.78 | 57.47,18.1 57.78,18.1 | 57.78,18.1 58.1,18.41 OUT27.2 | OUT30.2 45.4,18.1 OUT26.2 | OUT29.2 32.7,18.1 32.7,23.97 32.86,24.13 OUT25.2 | OUT28.2 20,18.1 OUT24.2 | IC8.10 68.26,7.94 66.99,9.21 62.23,9.21 60.01,11.43 OUT31.2 58.1,17.78 | 58.1,17.78
  Top 1.93: 57.47,18.1 45.4,18.1 32.7,18.1 20,18.1 15.56,18.1 10.16,23.5 10.16,44.77 6.31,48.62 X1.7
N$86
  Top 0.254: RN13.6 77.86,14.53 75.56,16.83 68.26,16.83 66.99,15.56 IC8.6
N$87
  Top 0.254: IC5.7 103.41,32.92 104.46,33.97 105.41,33.97 | 105.41,33.97 XTAL1.2 | C6.1 107,35.56 105.41,33.97
N$88
  Top 0.254: IC5.8 102.61,32.96 101.6,33.97 100.65,33.97 | 100.65,33.97 XTAL1.1 | C5.1 99.06,35.56 100.65,33.97
N$89
  Top 0.254: RN13.5 78.02,15.33 73.98,19.37 68.26,19.37 66.99,18.1 IC8.5
N$90
  Top 0.254: RN12.8 77.7,23.09 76.52,21.91 68.26,21.91 66.99,20.64 IC8.4
N$91
  Top 0.254: RN12.7 77.71,23.89 77.15,24.45 68.26,24.45 66.99,23.18 IC8.3
N$92
  Top 0.254: RN12.6 77.86,24.69 75.56,26.99 68.26,26.99 66.99,25.72 IC8.2
N$93
  Top 0.254: RN12.5 78.02,25.49 73.98,29.53 68.26,29.53 66.99,28.26 IC8.1
N$94
  Top 0.254: RN11.8 78.02,41.19 76.52,39.69 68.26,39.69 66.99,38.42 IC9.8
N$95
  Top 0.254: RN11.7 77.71,41.99 77.47,42.23 68.26,42.23 66.99,40.96 IC9.7
N$96
  Top 0.254: RN11.6 77.86,42.79 75.88,44.77 68.26,44.77 66.99,43.5 IC9.6
N$97
  Top 0.254: RN11.5 78.02,43.59 74.3,47.31 68.26,47.31 66.99,46.04 IC9.5
N$98
  Top 0.254: RN10.8 77.06,51.35 75.56,49.85 68.26,49.85 66.99,48.58 IC9.4
N$99
  Top 0.254: RN10.7 77.71,52.15 77.47,52.39 68.26,52.39 66.99,51.12 IC9.3
N$100
  Top 0.254: RN10.6 77.86,52.95 75.88,54.93 68.26,54.93 66.99,53.66 IC9.2
N$101
  Top 0.254: RN10.5 78.02,53.75 74.3,57.47 68.26,57.47 66.99,56.2 IC9.1
N$102
  Bottom 0.813: X2.1 109.06,115.09 D1.A
N$104
  Top 0.813: D1.C 118.11,95.89 C11.+ 118.11,93.66 114.61,90.16 C14.+ 107.71,89.29 IC7.3
N$138
  Top 0.254: RN1.2 S1.1 104.78,63.18 106.05,61.91 111.12,61.91 115.25,57.78 115.25,29.53 116.2,28.57 116.2,19.37 112.08,15.24 107.95,15.24 107.41,15.78 IC5.23
N$139
  Top 0.254: RN1.3 S1.2 104.78,60.64 106.05,59.37 111.12,59.37 114.62,55.88 114.62,29.21 115.57,28.26 115.57,19.68 112.55,16.66 IC5.24
N$140
  Top 0.254: RN1.4 S1.3 104.78,58.1 106.05,56.83 111.12,56.83 113.98,53.98 113.98,28.89 114.94,27.94 114.94,20 113.09,18.16 IC5.25
N$190
  Top 0.254: RN1.5 S1.4 104.78,55.56 106.05,54.29 111.12,54.29 113.35,52.07 113.35,28.57 114.3,27.62 114.3,20.32 112.94,18.95 IC5.26
N$191
  Top 0.254: RN1.6 S1.5 104.78,53.02 106.05,51.75 111.12,51.75 112.71,50.16 112.71,28.26 113.67,27.3 113.67,20.64 112.78,19.75 IC5.27
N$192
  Top 0.254: RN1.7 S1.6 104.78,50.48 106.05,49.21 111.12,49.21 112.08,48.26 112.08,27.94 113.03,26.99 113.03,20.95 112.63,20.55 IC5.28
N$209
  Top 0.254: RN1.8 S1.7 104.78,47.94 106.05,46.67 111.12,46.67 111.44,46.35 111.44,27.94 109.86,26.35 108.27,26.35 108.21,26.3 IC5.1
N$210
  Top 0.254: RN1.9 S1.8 104.78,45.4 108.9,41.27 108.9,27.3 108.58,26.99 107.95,26.99 107.41,26.45 IC5.2
N$226  (via drill 0.5)
  Top 0.254: IC5.30 111.19,22.16 v111.76,21.59 | 105.41,101.92 IC6.1 v112.08,101.92
  Bottom 0.254: v111.76,21.59 113.03,21.59 113.67,22.23 113.67,100.33 v112.08,101.92
N$227  (via drill 0.5)
  Top 0.254: IC5.31 111.67,22.95 v111.76,22.86 | v109.86,105.73 IC6.4
  Bottom 0.254: v111.76,22.86 112.71,22.86 113.03,23.18 113.03,99.38 110.49,101.92 110.49,105.09 v109.86,105.73
N$228  (via drill 0.5)
  Top 0.254: IC6.2 106.68,103.19 v107.31,103.82 | v107.31,103.82 R2.2 | IC6.3 106.68,104.46 v107.31,103.82 | IC5.32 111.39,23.75 v111.76,24.13
  Bottom 0.254: v111.76,24.13 112.08,24.13 112.39,24.45 112.39,98.74 v107.31,103.82
N$231  (via drill 0.5)
  Top 0.254: JP1.5 99.69,11.11 100.65,12.06 R1.1 | IC5.29 107.72,21.36 v107.31,20.95
  Bottom 0.254: v107.31,20.95 99.69,13.34 JP1.5
RS285_A
  Top 0.254: IC6.6 97.16,104.46 89.06,112.55 X2.5
RS485_B
  Top 0.254: IC6.7 100.97,103.19 101.28,103.5 101.28,106.68 99.06,108.9 X2.3
SERVO_CS  (via drill 0.5)
  Top 0.254: v94.3,79.38 90.17,79.38 87.68,81.86 IC1.11 | IC2.11 87.68,26.3 90.17,23.81 v94.3,23.81 | IC5.14 94.55,19.75 v94.3,20
  Bottom 0.254: 94.3,9.84 v94.3,20 v94.3,79.38 | v94.3,79.38 v94.3,23.81 v94.3,79.38
SERVO_MISO  (via drill 0.5)
  Top 0.254: IC1.14 89.63,82.77 90.17,82.23 v91.44,82.23 | IC2.14 89.63,27.21 90.17,26.67 v91.44,26.67 | IC5.16 92.77,18.16 92.39,17.78 v91.44,17.78
  Bottom 0.254: v91.44,82.23 v91.44,17.78 91.44,7.3 92.39,6.35 JP1.9 | v91.44,82.23 v91.44,26.67 v91.44,82.23
SERVO_MOSI  (via drill 0.5)
  Top 0.254: IC1.13 88.98,82.47 90.17,81.28 v92.39,81.28 | IC2.13 88.98,26.91 90.17,25.72 v92.39,25.72 | IC5.15 92.49,18.95 v92.39,19.05
  Bottom 0.254: v92.39,81.28 v92.39,19.05 92.39,8.26 93.03,7.62 95.57,7.62 95.89,7.3 95.89,5.71 96.52,5.08 103.5,5.08 JP1.1 | v92.39,81.28 v92.39,25.72 v92.39,81.28
SERVO_SCLK  (via drill 0.5)
  Top 0.254: v93.34,80.33 90.17,80.33 88.33,82.17 IC1.12 | IC2.12 88.33,26.6 90.17,24.77 v93.34,24.77 | IC5.17 93.51,16.66 v93.34,16.83
  Bottom 0.254: v93.34,80.33 v93.34,16.83 93.34,8.89 93.98,8.26 96.52,8.26 97.16,7.62 JP1.7 | v93.34,80.33 v93.34,24.77 v93.34,80.33
SRV0
  Top 0.61: 57.47,102.08 57.94,102.08 | 57.94,102.08 58.1,101.92 OUT7.2 60.01,95.25 62.23,93.03 66.99,93.03 68.26,91.76 IC3.10 | OUT3.2 58.1,102.23 57.94,102.08 | 45.4,102.08 45.4,102.23 | 45.4,102.23 OUT6.2 | 45.4,102.23 | 45.4,102.23 OUT2.2 | 32.7,102.08 OUT5.2 | 32.7,102.08 | 32.7,102.08 OUT1.2 | OUT4.2 20,101.92 20,102.08 OUT0.2
  Top 1.93: 13.97,102.08 20,102.08 26.04,102.08 | 26.04,102.08 32.7,102.08 36.2,102.08 | 13.97,102.08 | 11.27,99.38 13.97,102.08 | 26.04,102.08 | 36.2,102.08 | 36.2,102.08 45.4,102.08 57.47,102.08 | X1.1 9.09,78.62 11.27,80.8 11.27,99.38 | 11.27,99.38

### Text on the board
tPlace: PowerMatrix
tNames: DPWR: 7-12V DC | A | G | B | - | + | - | - | - | - | RS485 | DPWR | + | + | + | + | POSITIVE WIRES THIS SIDE | + | + | + | + | - | - | - | - | - | - | - | - | + | SPWR | + | + | + | + | - | http://www.mondomatrix.com/ | POSITIVE WIRES THIS SIDE | Version 1.1 | + | SPWR | + | + | + | + | - | - | - | - | - | 0 | 1 | + | SPWR | 2 | 3 | - | - | - | - | - | 4 | + | + | + | + | 5 | + | SPWR | ADDRESS | 6 | 7 | - | POSITIVE WIRES THIS SIDE | + | + | + | + | - | - | - | - | - | - | - | - | + | + | + | + | POSITIVE WIRES THIS SIDE | + | + | + | + | - | - | - | -